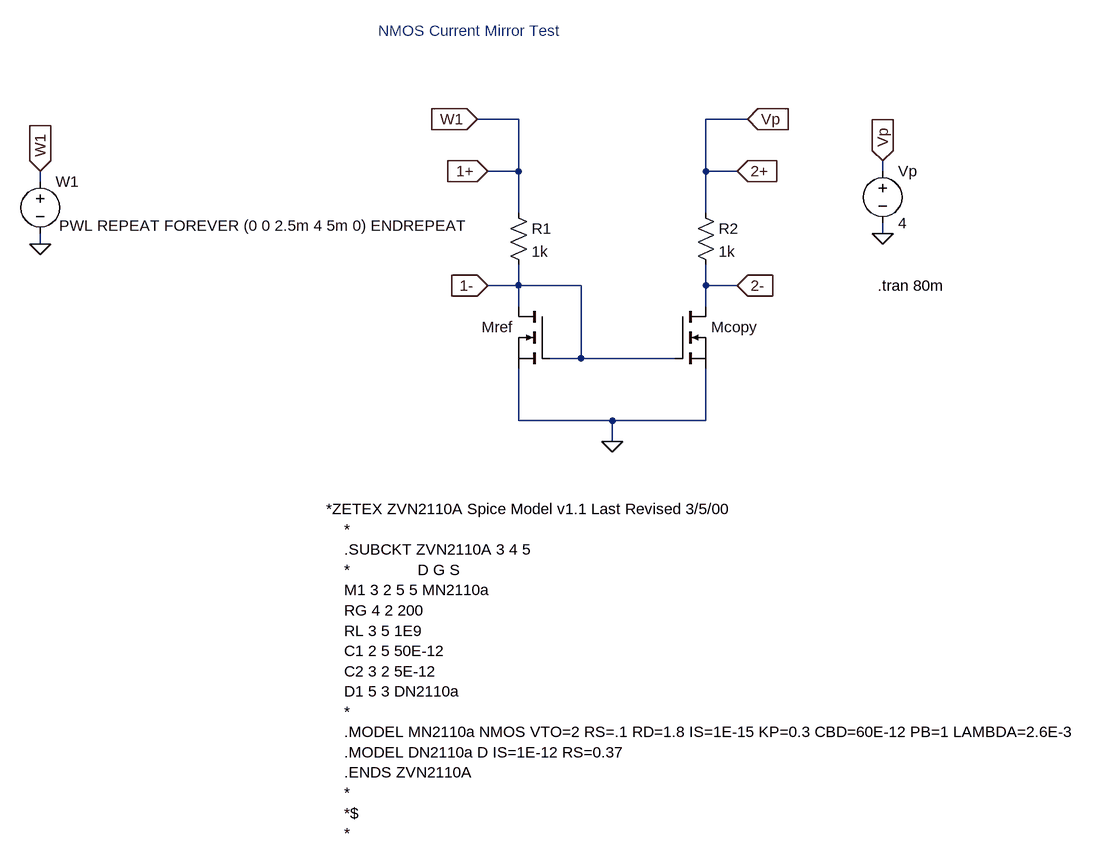
[diagram p0: schematic nmos_mirror.asc]
nmos_mirror.asc, the LTspice schematic file:
Version 4
SHEET 1 2016 1044
WIRE -208 -64 -272 -64
WIRE 144 -64 80 -64
WIRE -208 16 -208 -64
WIRE -208 16 -256 16
WIRE 80 16 80 -64
WIRE 128 16 80 16
WIRE 352 16 352 0
WIRE -944 32 -944 16
WIRE -208 80 -208 16
WIRE 80 80 80 16
WIRE 352 112 352 96
WIRE -944 128 -944 112
WIRE -208 192 -208 160
WIRE -208 192 -256 192
WIRE -112 192 -208 192
WIRE 80 192 80 160
WIRE 128 192 80 192
WIRE -208 224 -208 192
WIRE 80 224 80 192
WIRE -112 304 -112 192
WIRE -112 304 -160 304
WIRE 32 304 -112 304
WIRE -208 400 -208 320
WIRE -64 400 -208 400
WIRE 80 400 80 320
WIRE 80 400 -64 400
WIRE -64 432 -64 400
FLAG -944 128 0
FLAG 352 112 0
FLAG -944 16 W1
IOPIN -944 16 In
FLAG 352 0 Vp
IOPIN 352 0 In
FLAG -64 432 0
FLAG -272 -64 W1
IOPIN -272 -64 In
FLAG 144 -64 Vp
IOPIN 144 -64 In
FLAG -256 16 1+
IOPIN -256 16 In
FLAG -256 192 1-
IOPIN -256 192 In
FLAG 128 16 2+
IOPIN 128 16 In
FLAG 128 192 2-
IOPIN 128 192 In
SYMBOL voltage -944 16 R0
WINDOW 3 29 84 Left 2
WINDOW 123 0 0 Left 0
WINDOW 39 0 0 Left 0
SYMATTR Value PWL REPEAT FOREVER (0 0 2.5m 4 5m 0) ENDREPEAT
SYMATTR InstName W1
SYMBOL voltage 352 0 R0
WINDOW 123 0 0 Left 0
WINDOW 39 0 0 Left 0
SYMATTR InstName Vp
SYMATTR Value 4
SYMBOL res -224 64 R0
SYMATTR InstName R1
SYMATTR Value 1k
SYMBOL res 64 64 R0
SYMATTR InstName R2
SYMATTR Value 1k
SYMBOL nmos -160 224 M0
WINDOW 3 56 72 Invisible 2
SYMATTR Value ZVN2110A
SYMATTR InstName Mref
SYMATTR Prefix X
SYMBOL nmos 32 224 R0
WINDOW 3 56 72 Invisible 2
SYMATTR Value ZVN2110A
SYMATTR InstName Mcopy
SYMATTR Prefix X
TEXT -424 -200 Left 2 ;NMOS Current Mirror Test
TEXT 344 192 Left 2 !.tran 80m
TEXT -504 536 Left 2 !*ZETEX ZVN2110A Spice Model v1.1 Last Revised 3/5/00\n    *\n    .SUBCKT ZVN2110A 3 4 5\n    *               D G S\n    M1 3 2 5 5 MN2110a\n    RG 4 2 200\n    RL 3 5 1E9\n    C1 2 5 50E-12\n    C2 3 2 5E-12\n    D1 5 3 DN2110a\n    *\n    .MODEL MN2110a NMOS VTO=2 RS=.1 RD=1.8 IS=1E-15 KP=0.3 CBD=60E-12 PB=1 LAMBDA=2.6E-3\n    .MODEL DN2110a D IS=1E-12 RS=0.37\n    .ENDS ZVN2110A\n    *\n    *$\n    *

The netlist it stands for:
* nmos_mirror.asc
V§W1 1+ 0 PWL REPEAT FOREVER (0 0 2.5m 4 5m 0) ENDREPEAT
Vp 2+ 0 4
R1 1+ 1- 1k
R2 2+ 2- 1k
XMref 1- 1- 0 ZVN2110A  ; pins D G S
XMcopy 2- 1- 0 ZVN2110A  ; pins D G S
* NMOS Current Mirror Test
.tran 80m
*ZETEX ZVN2110A Spice Model v1.1 Last Revised 3/5/00
    *
    .SUBCKT ZVN2110A 3 4 5
    *               D G S
    M1 3 2 5 5 MN2110a
    RG 4 2 200
    RL 3 5 1E9
    C1 2 5 50E-12
    C2 3 2 5E-12
    D1 5 3 DN2110a
    *
    .MODEL MN2110a NMOS VTO=2 RS=.1 RD=1.8 IS=1E-15 KP=0.3 CBD=60E-12 PB=1 LAMBDA=2.6E-3
    .MODEL DN2110a D IS=1E-12 RS=0.37
    .ENDS ZVN2110A
    *
    *$
    *
.backanno
.end